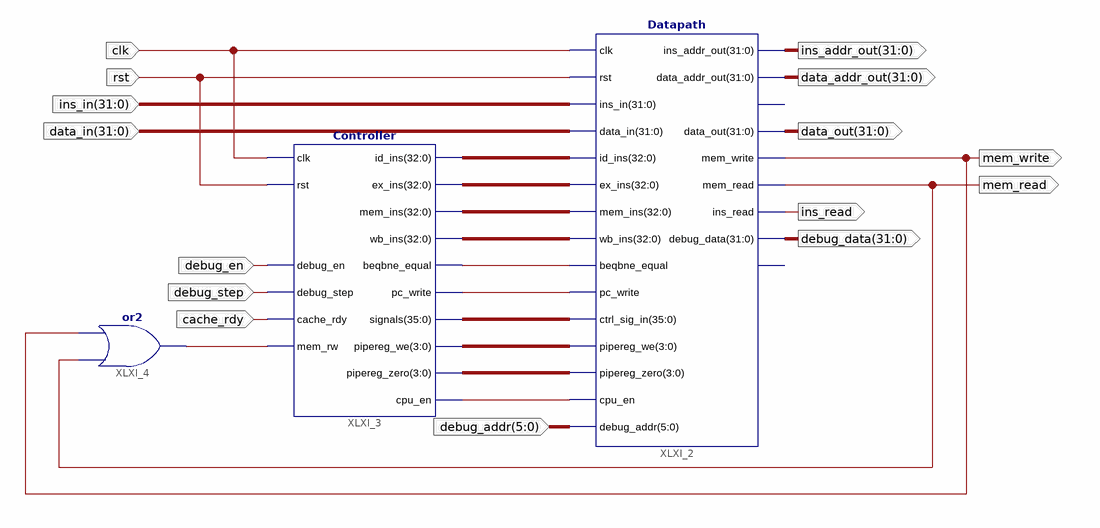
[diagram p0: schematic sheet 1]
// Xilinx ISE schematic pipelined_cpu.sch (kintex7) as structural Verilog: 3 symbols, 15 ports
module pipelined_cpu (
  input  clk,
  input  rst,
  input  [31:0] ins_in,
  input  [31:0] data_in,
  input  [5:0] debug_addr,
  input  debug_en,
  input  debug_step,
  input  cache_rdy,
  output [31:0] ins_addr_out,
  output [31:0] data_addr_out,
  output [31:0] data_out,
  output mem_write,
  output mem_read,
  output ins_read,
  output [31:0] debug_data
);

  wire XLXN_39, XLXN_40, XLXN_44, XLXN_48;
  wire [3:0] XLXN_42, XLXN_43;
  wire [32:0] XLXN_36, XLXN_37, XLXN_38, XLXN_47;
  wire [35:0] XLXN_41;

  Datapath XLXI_2 (
    .ins_addr_out(ins_addr_out), .clk(clk), .rst(rst), .ins_in(ins_in), .data_addr_out(data_addr_out),
    .data_out(data_out), .mem_write(mem_write), .mem_read(mem_read), .ins_read(ins_read),
    .debug_data(debug_data), .pc_write(XLXN_40), .ctrl_sig_in(XLXN_41), .pipereg_we(XLXN_42),
    .pipereg_zero(XLXN_43), .beqbne_equal(XLXN_39), .cpu_en(XLXN_44), .debug_addr(debug_addr),
    .data_in(data_in), .ex_ins(XLXN_36), .mem_ins(XLXN_37), .wb_ins(XLXN_38), .id_ins(XLXN_47));  // open: overflow, zero
  Controller XLXI_3 (
    .clk(clk), .rst(rst), .id_ins(XLXN_47), .pc_write(XLXN_40), .beqbne_equal(XLXN_39), .signals(XLXN_41),
    .pipereg_we(XLXN_42), .pipereg_zero(XLXN_43), .cpu_en(XLXN_44), .debug_en(debug_en),
    .debug_step(debug_step), .ex_ins(XLXN_36), .mem_ins(XLXN_37), .wb_ins(XLXN_38), .cache_rdy(cache_rdy),
    .mem_rw(XLXN_48));
  or XLXI_4 (XLXN_48, mem_read, mem_write);
endmodule
